# Altium schematic sheet CLK.schdoc: TEBF0808 - CLK
size A4; DocumentNumber: TEBF0808; Revision: 04; SheetNumber: 22; SheetTotal: 36; Date: 2016-09-29; CompanyName: Trenz Electronic GmbH; Organization: Trenz Electronic GmbH
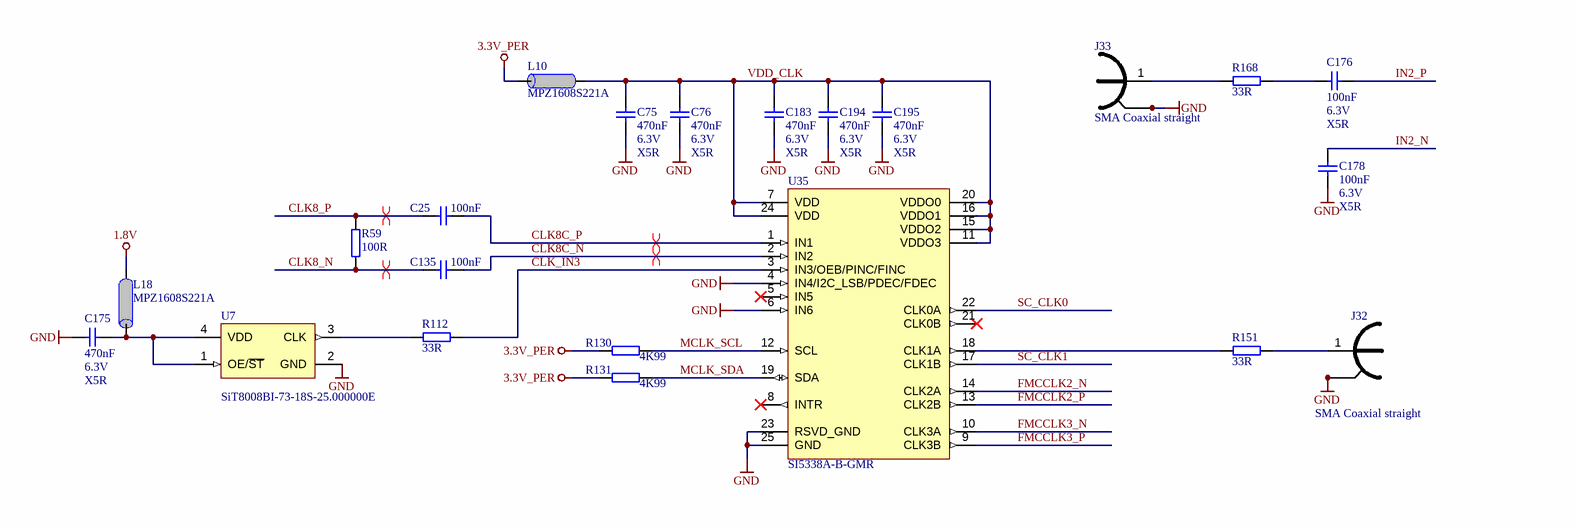
[diagram p0: CLK.schdoc]

## Parts
C25  100nF  [CAPC0603X33N]
C75  470nF  Voltage: 6.3V  Technology: X5R  [CAPC1005X55N]
C76  470nF  Voltage: 6.3V  Technology: X5R  [CAPC1005X55N]
C135  100nF  [CAPC0603X33N]
C175  470nF  Voltage: 6.3V  Technology: X5R  [CAPC1005X55N]
C176  100nF  Voltage: 6.3V  Technology: X5R  [CAPC0603X33N]
C178  100nF  Voltage: 6.3V  Technology: X5R  [CAPC0603X33N]
C183  470nF  Voltage: 6.3V  Technology: X5R  [CAPC1005X55N]
C194  470nF  Voltage: 6.3V  Technology: X5R  [CAPC1005X55N]
C195  470nF  Voltage: 6.3V  Technology: X5R  [CAPC1005X55N]
J32  SMA Coaxial straight  [SMA-R125426000]
J33  SMA Coaxial straight  [SMA-R125426000]
L10  MPZ1608S221A  [INDC1608X95N]
L18  MPZ1608S221A  [INDC1608X95N]
R59  100R  [RESC1005X40N]
R112  33R  [RESC1005X40N]
R130  4K99  [RESC1005X40N]
R131  4K99  [RESC1005X40N]
R151  33R  [RESC1005X40N]
R168  33R  [RESC1005X40N]
U7  SiT8008BI-73-18S-25.000000E  [2016]
U35  SI5338A-B-GMR  [QFN50P400X400X90-25N]

## Nets
1.8V: L18.1
3.3V_PER: L10.2 R130.1 R131.1
GND: C75.2 C76.2 C175.2 C178.1 C183.2 C194.2 C195.2 J32.2 J32.3 J32.4 J32.5 J33.2 J33.3 J33.4 J33.5 U7.2(GND) U35.4(IN4/I2C_LSB/PDEC/FDEC) U35.6(IN6) U35.23(RSVD_GND) U35.25(GND)
CLK8_N: C135.1 R59.2
CLK8_P: C25.1 R59.1
CLK8C_N: C135.2 U35.2(IN2)
CLK8C_P: C25.2 U35.1(IN1)
CLK_IN3: R112.2 U35.3(IN3/OEB/PINC/FINC)
FMCCLK2_N: U35.14(CLK2A)
FMCCLK2_P: U35.13(CLK2B)
FMCCLK3_N: U35.10(CLK3A)
FMCCLK3_P: U35.9(CLK3B)
IN2_N: C178.2
IN2_P: C176.1
MCLK_SCL: R130.2 U35.12(SCL)
MCLK_SDA: R131.2 U35.19(SDA)
SC_CLK0: U35.22(CLK0A)
SC_CLK1: U35.17(CLK1B)
VDD_CLK: C75.1 C76.1 C183.1 C194.1 C195.1 L10.1 U35.7(VDD) U35.11(VDDO3) U35.15(VDDO2) U35.16(VDDO1) U35.20(VDDO0) U35.24(VDD)
NetC175_1: C175.1 L18.2 U7.1(OE/~{ST}) U7.4(VDD)
NetC176_2: C176.2 R168.2
NetJ32_1: J32.1 R151.2
NetJ33_1: J33.1 R168.1
NetR112_1: R112.1 U7.3(CLK)
NetR151_1: R151.1 U35.18(CLK1A)

Not connected (* = marked no-connect by the designer): U35 5(IN5)* 8(INTR)* 21(CLK0B)*

## Layout directives
differential pair: CLK8_N, CLK8_P, CLK8C_N, CLK8C_P

## Notes on the sheet
- Title:
- Number:
- Rev.
- Date:
- A4
- Copyright:
- Page
- of
- Filename:

## Library data of the parts
C25 C135 C176 C178 = 24915: KON 100nF 6.3V X5R SMD 10%; AN: 24915; Mixed: SMT; Value: 100n; Preferred: Yes; Case: 0603 (0201); Tolerance: 10%
  C25 C135: Voltage: 6.3V; Technology: X5R
C75 C76 C175 C183 C194 C195 = 23659: KON 470nF 6,3V X5R SMD; AN: 23659; Value: 470n; Mixed: SMT; Preferred: Yes; Case: 1005 (0402)
J32 J33 = 22825: AN: 22825; Mixed: THT; Trenz-Stock: Yes; H-ART: R125426000; HelpURL: B:\AD\adlib\datasheet\R125426000
L10 L18 = 22718: Ferritdurchführung MPZ1608S221A; AN: 22718; Mixed: SMT; Trenz-Stock: Yes; Value: 220 OHm @ 100MHz; Case: 1608 (0603); HelpURL: B:\AD\adlib\datasheet\MPZ1608; Preferred: Yes; H-ART: MPZ1608S221A
R59 = 22507: WID SMD 100R 1% 0,063W; AN: 22507; Mixed: SMT; Value: 100; Preferred: Yes; Tolerance: 1%; Case: 1005 (0402); Technology: TK100
R112 R151 R168 = 22770: WID SMD 33R 1% 0,063W; AN: 22770; Mixed: SMT; Value: 33; Preferred: Yes; Tolerance: 1%; Case: 1005 (0402); Technology: TK100
R130 R131 = 22754: WID SMD 4K99 1% 0,063W; AN: 22754; Value: 4.99K; Mixed: SMT; Preferred: Yes; Case: 1005 (0402); Tolerance: 1%; Technology: TK100
U7 = 27228: AN: 27228; Value: 25M; Mixed: SMT; Preferred: Yes; Voltage: 1.8V; Case: 2.0  x 1.6mm; HelpURL: B:\AD\adlib\datasheet\SiT8008; H-ART: SIT8008BI-73-18S-25.000000E
U35 = 25121: SI5338A-B-GM; AN: 25121; Mixed: SMT; Trenz-Stock: Yes; Case: QFN24; HelpURL: B:\AD\adlib\datasheet\SI5338A; Preferred: Yes; H-ART: SI5338A-B-GM